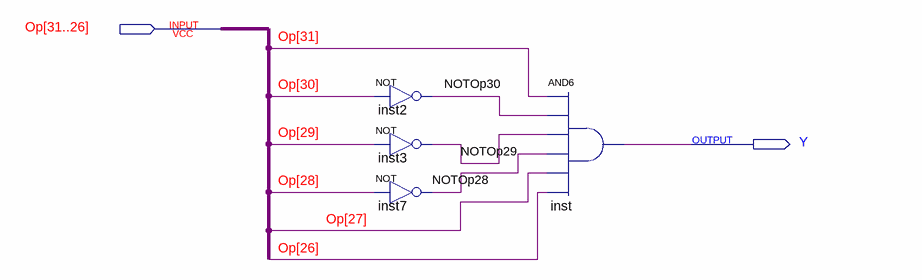
[diagram p0: schematic sheet]
// Quartus schematic LW.bdf as structural Verilog: 4 symbols, 2 pins
module LW (
  input  [31:26] Op,
  output Y
);

  wire NOTOp28, NOTOp29, NOTOp30;

  not inst2 (NOTOp30, Op[30]);
  not inst3 (NOTOp29, Op[29]);
  not inst7 (NOTOp28, Op[28]);
  and inst (Y, Op[31], NOTOp30, NOTOp29, NOTOp28, Op[27], Op[26]);
endmodule
